# Altium schematic sheet CarteDetection.SchDoc
size A4
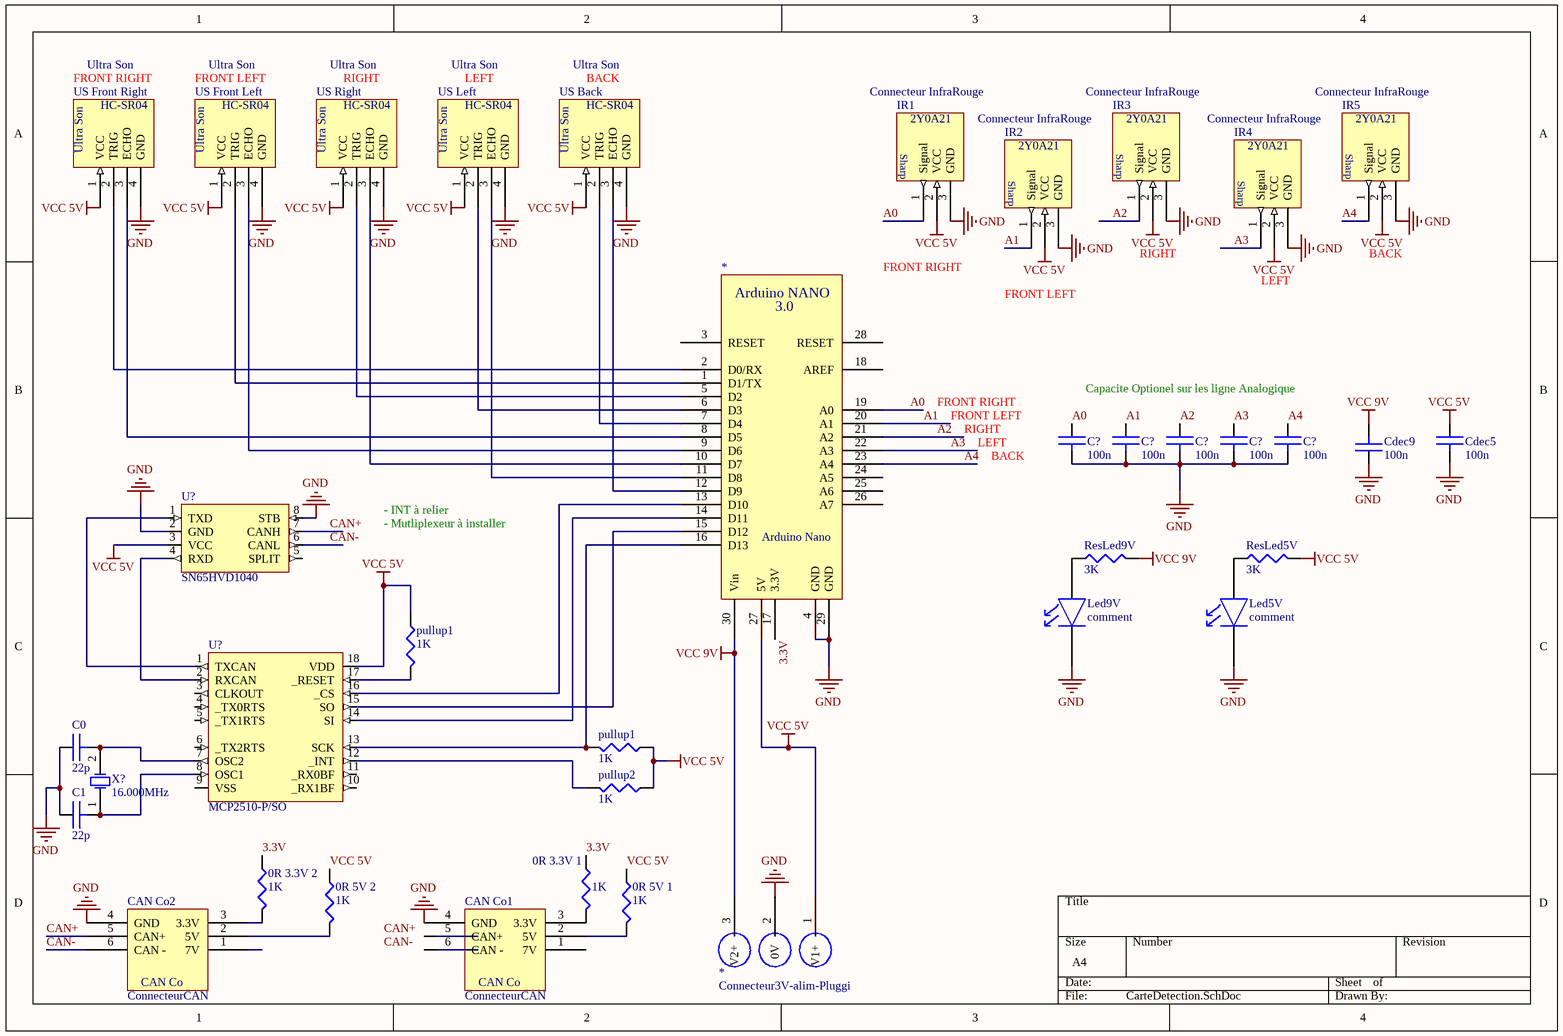
[diagram p0: CarteDetection.SchDoc]

## Parts
(Parts that share a designator on the sheet are numbered #1, #2 ... from top to bottom, then left to right.)
0R_3.3V_1  value 1K  [0805]  (hidden comment: RES)
0R_3.3V_2  value 1K  [0805]  (hidden comment: RES)
0R_5V_1  value 1K  [0805]  (hidden comment: RES)
0R_5V_2  value 1K  [0805]  (hidden comment: RES)
*#1  Arduino Nano  [Arduino Nano FootPrint]
*#2  Connecteur3V-alim-Pluggi  [CONNECTEUR3V-ALIM-PLUGGI]
C0  value 22p  [0805]  (hidden comment: CAP)
C1  value 22p  [0805]  (hidden comment: CAP)
C?#1  value 100n  [0805]  (hidden comment: CAP)
C?#2  value 100n  [0805]  (hidden comment: CAP)
C?#3  value 100n  [0805]  (hidden comment: CAP)
C?#4  value 100n  [0805]  (hidden comment: CAP)
C?#5  value 100n  [0805]  (hidden comment: CAP)
CAN_Co1  ConnecteurCAN  [CAN Connecteur]
CAN_Co2  ConnecteurCAN  [CAN Connecteur]
Cdec5  value 100n  [0805]  (hidden comment: CAP)
Cdec9  value 100n  [0805]  (hidden comment: CAP)
IR1  Connecteur InfraRouge  [Connecteur InfraRouge]
IR2  Connecteur InfraRouge  [Connecteur InfraRouge]
IR3  Connecteur InfraRouge  [Connecteur InfraRouge]
IR4  Connecteur InfraRouge  [Connecteur InfraRouge]
IR5  Connecteur InfraRouge  [Connecteur InfraRouge]
Led5V  comment  [LED5]
Led9V  comment  [LED5]
pullup1#1  value 1K  [0805]  (hidden comment: RES)
pullup1#2  value 1K  [0805]  (hidden comment: RES)
pullup2  value 1K  [0805]  (hidden comment: RES)
ResLed5V  value 3K  [0805]  (hidden comment: RES)
ResLed9V  value 3K  [0805]  (hidden comment: RES)
U?#1  SN65HVD1040  [SO8]
U?#2  MCP2510-P/SO  [DIP18]
US_Back  Ultra Son  [Conecteur UltraSon]
US_Front_Left  Ultra Son  [Conecteur UltraSon]
US_Front_Right  Ultra Son  [Conecteur UltraSon]
US_Left  Ultra Son  [Conecteur UltraSon]
US_Right  Ultra Son  [Conecteur UltraSon]
X?  16.000MHz  [HC5U]

## Nets
GND: *#1.4(GND) *#1.29(GND) *#2.2(0V) C0.1 C1.1 C?#1.2 C?#2.2 C?#3.2 C?#4.2 C?#5.2 CAN_Co1.4(GND) CAN_Co2.4(GND) Cdec5.2 Cdec9.1 IR1.3(GND) IR2.3(GND) IR3.3(GND) IR4.3(GND) IR5.3(GND) Led5V.K Led9V.K U?#1.2(GND) U?#1.8(STB) US_Back.4(GND) US_Front_Left.4(GND) US_Front_Right.4(GND) US_Left.4(GND) US_Right.4(GND)
VCC 5V: 0R_5V_1.1 0R_5V_2.1 *#1.27(5V) *#2.1(V1+) Cdec5.1 IR1.2(VCC) IR2.2(VCC) IR3.2(VCC) IR4.2(VCC) IR5.2(VCC) pullup1#1.1 pullup1#2.1 pullup2.1 ResLed5V.2 U?#1.3(VCC) U?#2.18(VDD) US_Back.1(VCC) US_Front_Left.1(VCC) US_Front_Right.1(VCC) US_Left.1(VCC) US_Right.1(VCC)
VCC 9V: *#1.30(Vin) *#2.3(V2+) Cdec9.2 ResLed9V.2
3.3V: 0R_3.3V_1.1 0R_3.3V_2.1 *#1.17(3.3V)
A0: *#1.19(A0) C?#1.1 IR1.1(Signal)
A1: *#1.20(A1) C?#2.1 IR2.1(Signal)
A2: *#1.21(A2) C?#3.1 IR3.1(Signal)
A3: *#1.22(A3) C?#4.1 IR4.1(Signal)
A4: *#1.23(A4) C?#5.1 IR5.1(Signal)
CAN+: CAN_Co2.5(CAN+) U?#1.7(CANH)
CAN-: CAN_Co2.6(CAN_-) U?#1.6(CANL)
Net0R_3.3V_1_2: 0R_3.3V_1.2 CAN_Co1.3(3.3V)
Net0R_3.3V_2_2: 0R_3.3V_2.2 CAN_Co2.3(3.3V)
Net0R_5V_1_2: 0R_5V_1.2 CAN_Co1.2(5V)
Net0R_5V_2_2: 0R_5V_2.2 CAN_Co2.2(5V)
Net*#1_1: *#1.1(D1/TX) US_Front_Left.2(TRIG)
Net*#1_2: *#1.2(D0/RX) US_Front_Right.2(TRIG)
Net*#1_5: *#1.5(D2) US_Right.2(TRIG)
Net*#1_6: *#1.6(D3) US_Left.2(TRIG)
Net*#1_7: *#1.7(D4) US_Back.2(TRIG)
Net*#1_8: *#1.8(D5) US_Front_Right.3(ECHO)
Net*#1_9: *#1.9(D6) US_Front_Left.3(ECHO)
Net*#1_10: *#1.10(D7) US_Right.3(ECHO)
Net*#1_11: *#1.11(D8) US_Left.3(ECHO)
Net*#1_12: *#1.12(D9) US_Back.3(ECHO)
Net*#1_13: *#1.13(D10) U?#2.16(_CS)
Net*#1_14: *#1.14(D11) U?#2.14(SI)
Net*#1_15: *#1.15(D12) U?#2.15(SO)
Net*#1_16: *#1.16(D13) pullup1#2.2 U?#2.13(SCK)
NetC0_2: C0.2 U?#2.7(OSC2) X?.2(OSC2)
NetC1_2: C1.2 U?#2.8(OSC1) X?.1(OSC1)
NetLed5V_A: Led5V.A ResLed5V.1
NetLed9V_A: Led9V.A ResLed9V.1
Netpullup1#1_2: pullup1#1.2 U?#2.17(_RESET)
Netpullup2_2: pullup2.2 U?#2.12(_INT)
NetU?#1_1: U?#1.1(TXD) U?#2.1(TXCAN)
NetU?#1_4: U?#1.4(RXD) U?#2.2(RXCAN)

Not connected (* = marked no-connect by the designer): *#1 3(RESET) 18(AREF) 24(A5) 25(A6) 26(A7) 28(RESET); CAN_Co1 1(7V) 5(CAN+) 6(CAN_-); CAN_Co2 1(7V); U?#1 5(SPLIT); U?#2 3(CLKOUT) 4(_TX0RTS) 5(_TX1RTS) 6(_TX2RTS) 9(VSS) 10(_RX1BF) 11(_RX0BF)

## Notes on the sheet
- FRONT RIGHT
- FRONT LEFT
- RIGHT
- LEFT
- BACK
- (near C?#2) Capacite Optionel sur les ligne Analogique
- - INT à relier
- - Mutliplexeur à installer
- Labels drawn without touching a wire or pin: CAN+, CAN-
- (in symbol Arduino Nano) Arduino NANO; 3.0
- (in symbol Connecteur InfraRouge) 2Y0A21; Sharp
- (in symbol ConnecteurCAN) CAN Co
- (in symbol Ultra Son) HC-SR04

## Library data of the parts
0R_3.3V_1 0R_3.3V_2 0R_5V_1 0R_5V_2 pullup1#1 pullup1#2 pullup2 ResLed5V ResLed9V = RES: resistance
C0 C1 C?#1-C?#5 Cdec5 Cdec9 = CAP: capacité non polarisée
Led5V Led9V = LED: LED 5mm/3mm/CMS
U?#2 = MCP2510-P/SO: CAN controler
X? = XTAL: Quartz; Manufacturer: Generic Components; Class I: Oscillator; Class II: Crystal Oscillator; Published: 8-Jun-2000; Revision: July-2002: Re-released for DXP Platform.; Publisher: Altium Limited